# EAGLE schematic atum-le (EAGLE 6.5.0)
AUTHOR: Brad Campbell; REV: A; TITLE: Atum

## Sheet 1 of 2
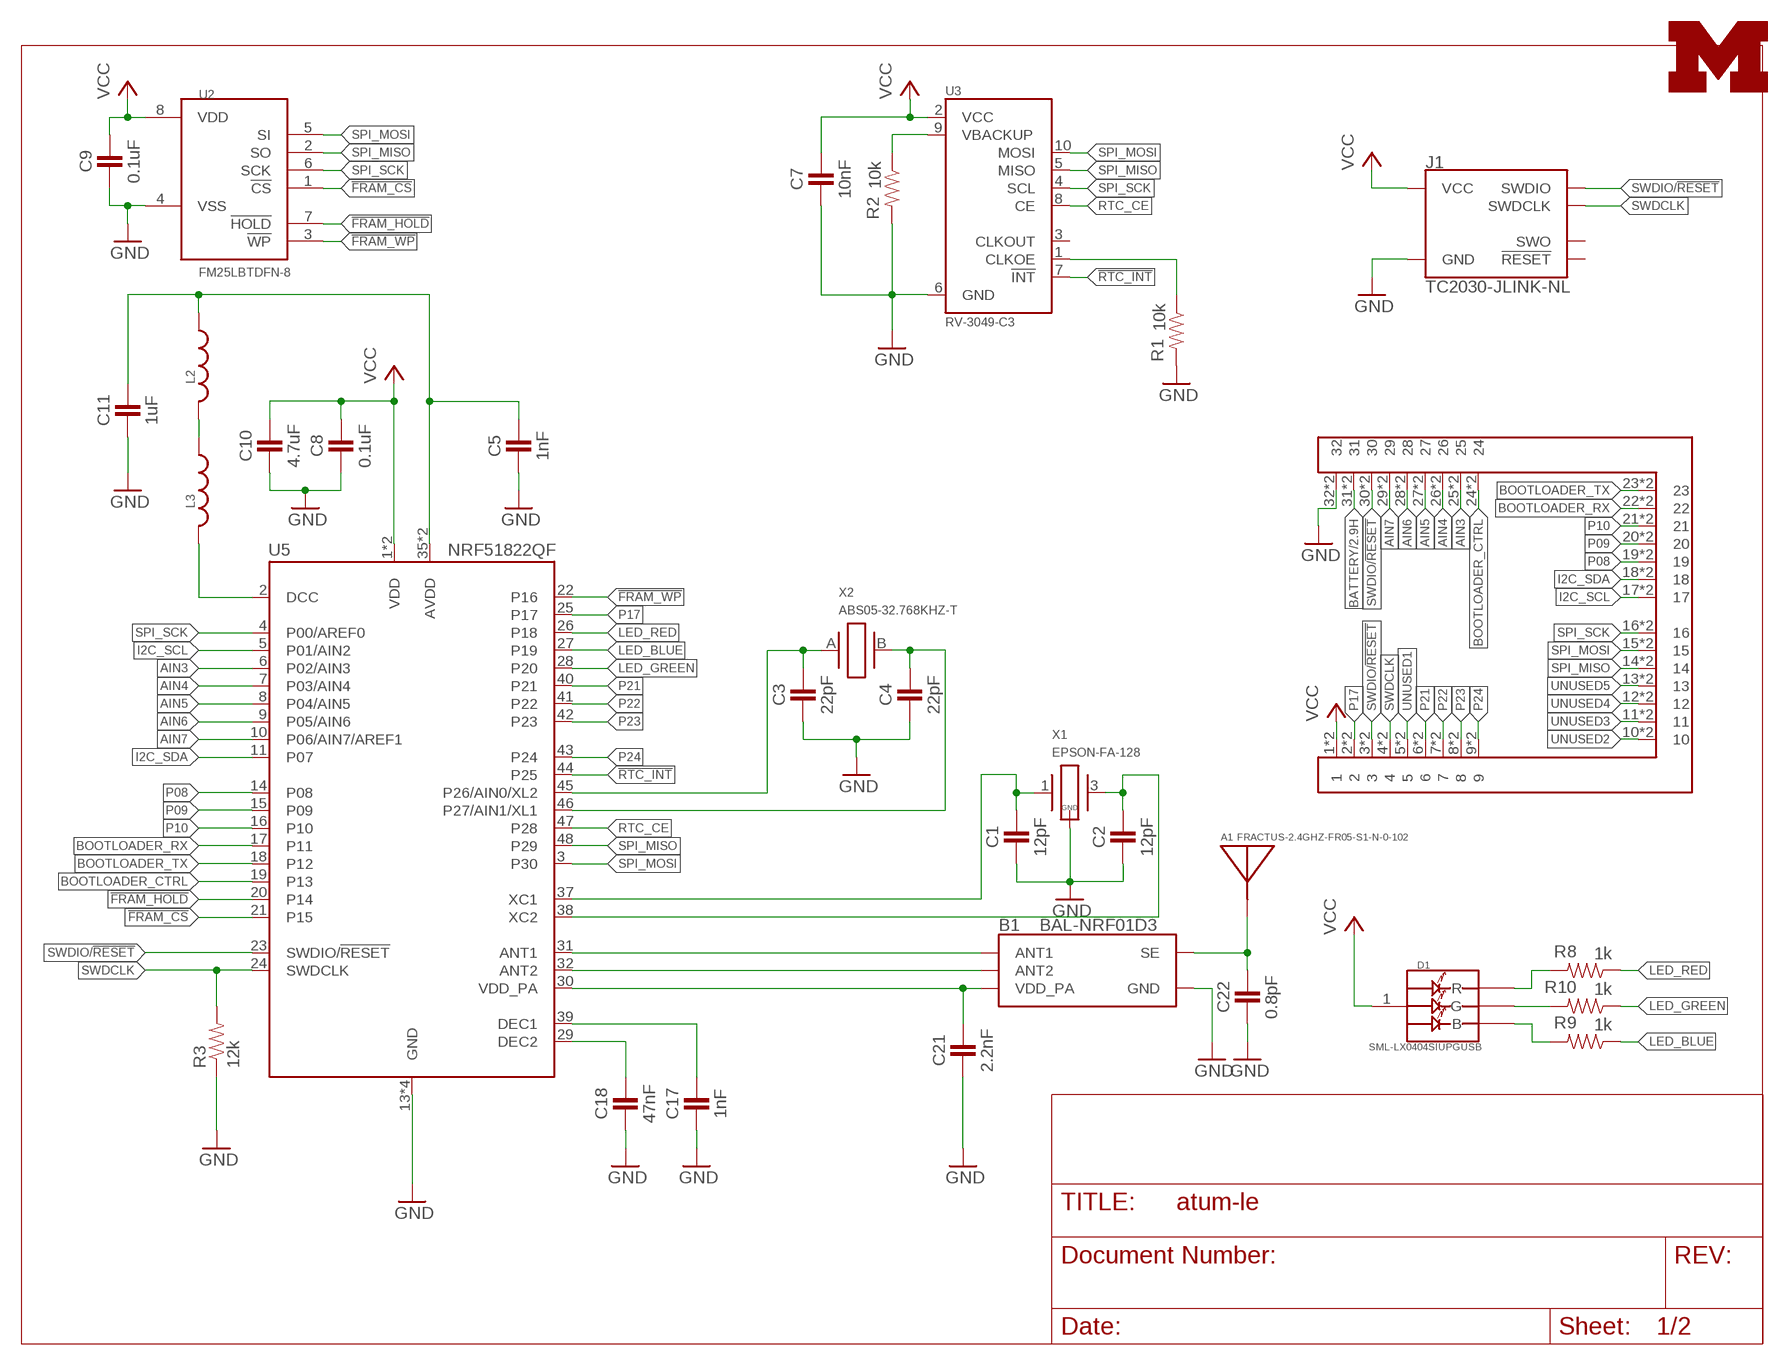
[diagram p0: schematic, sheet 1]

### Parts
A1  FRACTUS-2.4GHZ-FR05-S1-N-0-102  [FRACTUS-ANTENNA-FR05-S1-N-0-102]
B1  BAL-NRF01D3  [BAL-NRF01D3]
C1  12pF  CAPACITOR  [0402_CAP]
C2  12pF  CAPACITOR  [0402_CAP]
C3  22pF  CAPACITOR  [0402_CAP]
C4  22pF  CAPACITOR  [0402_CAP]
C5  1nF  CAPACITOR  [0402_CAP]
C7  10nF  CAPACITOR  [0402_CAP]
C8  0.1uF  CAPACITOR  [0402_CAP]
C9  0.1uF  CAPACITOR  [0402_CAP]
C10  4.7uF  CAPACITOR  [0402_CAP]
C11  1uF  CAPACITOR  [0402_CAP]
C17  1nF  CAPACITOR  [0402_CAP]
C18  47nF  CAPACITOR  [0402_CAP]
C21  2.2nF  CAPACITOR  [0402_CAP]
C22  0.8pF  CAPACITOR  [0402_CAP]
D1  SML-LX0404SIUPGUSB  [1MM_SQ_4PAD]
J1  TC2030-JLINK-NL  [TC2030-IDC-NL]
J3  ATUM-HEADER  [ATUM-HEADER]
L2  INDUCTOR0402  [0402_CAP]
L3  INDUCTOR0603  [0603_CAP]
LOGO1  UMICH_SOLID_TINY  [UMICH_SOLID_50MIL]
R1  10k  RESISTOR0402_RES  [0402_RES]
R2  10k  RESISTOR0402_RES  [0402_RES]
R3  12k  RESISTOR0402_RES  [0402_RES]
R8  1k  RESISTOR0402_RES  [0402_RES]
R9  1k  RESISTOR0402_RES  [0402_RES]
R10  1k  RESISTOR0402_RES  [0402_RES]
U2  FM25LBTDFN-8  [TDFN-8]
U3  RV-3049-C3  [MICRO-CRYSTAL-C3]
U5  NRF51822QF  [QFN-48-6MM]
X1  EPSON-FA-128  [FA-128]
X2  ABS05-32.768KHZ-T  [ABS05]

### Nets
!FRAM_CS: U2.1(!CS) U5.21(P15)
!FRAM_HOLD: U2.7(!HOLD) U5.20(P14)
!FRAM_WP: U2.3(!WP) U5.22(P16)
!RTC_INT: U3.7(!INT) U5.44(P25)
AIN3: J3.25 J3.25B U5.6(P02/AIN3)
AIN4: J3.26 J3.26B U5.7(P03/AIN4)
AIN5: J3.27 J3.27B U5.8(P04/AIN5)
AIN6: J3.28 J3.28B U5.9(P05/AIN6)
AIN7: J3.29 J3.29B U5.10(P06/AIN7/AREF1)
ANTENNA: A1.1(ANTENNA) B1.SE C22.1
BATTERY: J3.31 J3.31B ; also sheet 2
BOOTLOADER_CTRL: J3.24 J3.24B U5.19(P13)
BOOTLOADER_RX: J3.22 J3.22B U5.17(P11)
BOOTLOADER_TX: J3.23 J3.23B U5.18(P12)
GND: B1.GND C1.2 C2.2 C3.2 C4.2 C5.2 C7.2 C8.2 C9.2 C10.2 C11.2 C17.2 C18.2 C21.2 C22.2 J1.5(GND) J3.32 J3.32B R1.2 R2.2 R3.1 U2.4(VSS) U3.6(GND) X1.2(GND) X1.4(GND) ; also sheet 2
I2C_SCL: J3.17 J3.17B U5.5(P01/AIN2)
I2C_SDA: J3.18 J3.18B U5.11(P07)
LED_BLUE: R9.1 U5.27(P19)
LED_GREEN: R10.1 U5.28(P20)
LED_RED: R8.1 U5.26(P18)
N$6: C3.1 U5.45(P26/AIN0/XL2) X2.A
N$7: D1.2(R) R8.2
N$9: C1.1 U5.37(XC1) X1.1
N$10: C2.1 U5.38(XC2) X1.3
N$11: D1.4(G) R10.2
N$12: D1.3(B) R9.2
N$13: C4.1 U5.46(P27/AIN1/XL1) X2.B
N$14: R2.1 U3.9(VBACKUP)
N$15: C18.1 U5.29(DEC2)
N$16: R1.1 U3.1(CLKOE)
N$17: C17.1 U5.39(DEC1)
N$18: B1.ANT1 U5.31(ANT1)
N$19: B1.ANT2 U5.32(ANT2)
N$20: B1.VCC(VDD_PA) C21.1 U5.30(VDD_PA)
N$36: C5.1 C11.1 L2.1 U5.35(AVDD) U5.36(AVDD)
N$37: L2.2 L3.1
N$38: L3.2 U5.2(DCC)
P08: J3.19 J3.19B U5.14(P08)
P09: J3.20 J3.20B U5.15(P09)
P10: J3.21 J3.21B U5.16(P10)
P17: J3.2 J3.2B U5.25(P17)
P21: J3.6 J3.6B U5.40(P21)
P22: J3.7 J3.7B U5.41(P22)
P23: J3.8 J3.8B U5.42(P23)
P24: J3.9 J3.9B U5.43(P24)
RTC_CE: U3.8(CE) U5.47(P28)
SPI_MISO: J3.14 J3.14B U2.2(SO) U3.5(MISO) U5.48(P29)
SPI_MOSI: J3.15 J3.15B U2.5(SI) U3.10(MOSI) U5.3(P30)
SPI_SCK: J3.16 J3.16B U2.6(SCK) U3.4(SCL) U5.4(P00/AREF0)
SWDCLK: J1.4(SWDCLK) J3.4 J3.4B R3.2 U5.24(SWDCLK)
SWDIO/!RESET: J1.2(SWDIO) J3.3 J3.3B J3.30 J3.30B U5.23(SWDIO/!RESET)
UNUSED1: J3.5 J3.5B
UNUSED2: J3.10 J3.10B
UNUSED3: J3.11 J3.11B
UNUSED4: J3.12 J3.12B
UNUSED5: J3.13 J3.13B
VCC: C7.1 C8.1 C9.1 C10.1 D1.1(VDD) J1.1(VCC) J3.1 J3.1B U2.8(VDD) U3.2(VCC) U5.1(VDD) U5.12(VDD) ; also sheet 2
Unconnected: J1.3(!RESET) J1.6(SWO) U3.3(CLKOUT) U5.13(GND) U5.33(GND) U5.34(GND) U5.GND

## Sheet 2 of 2
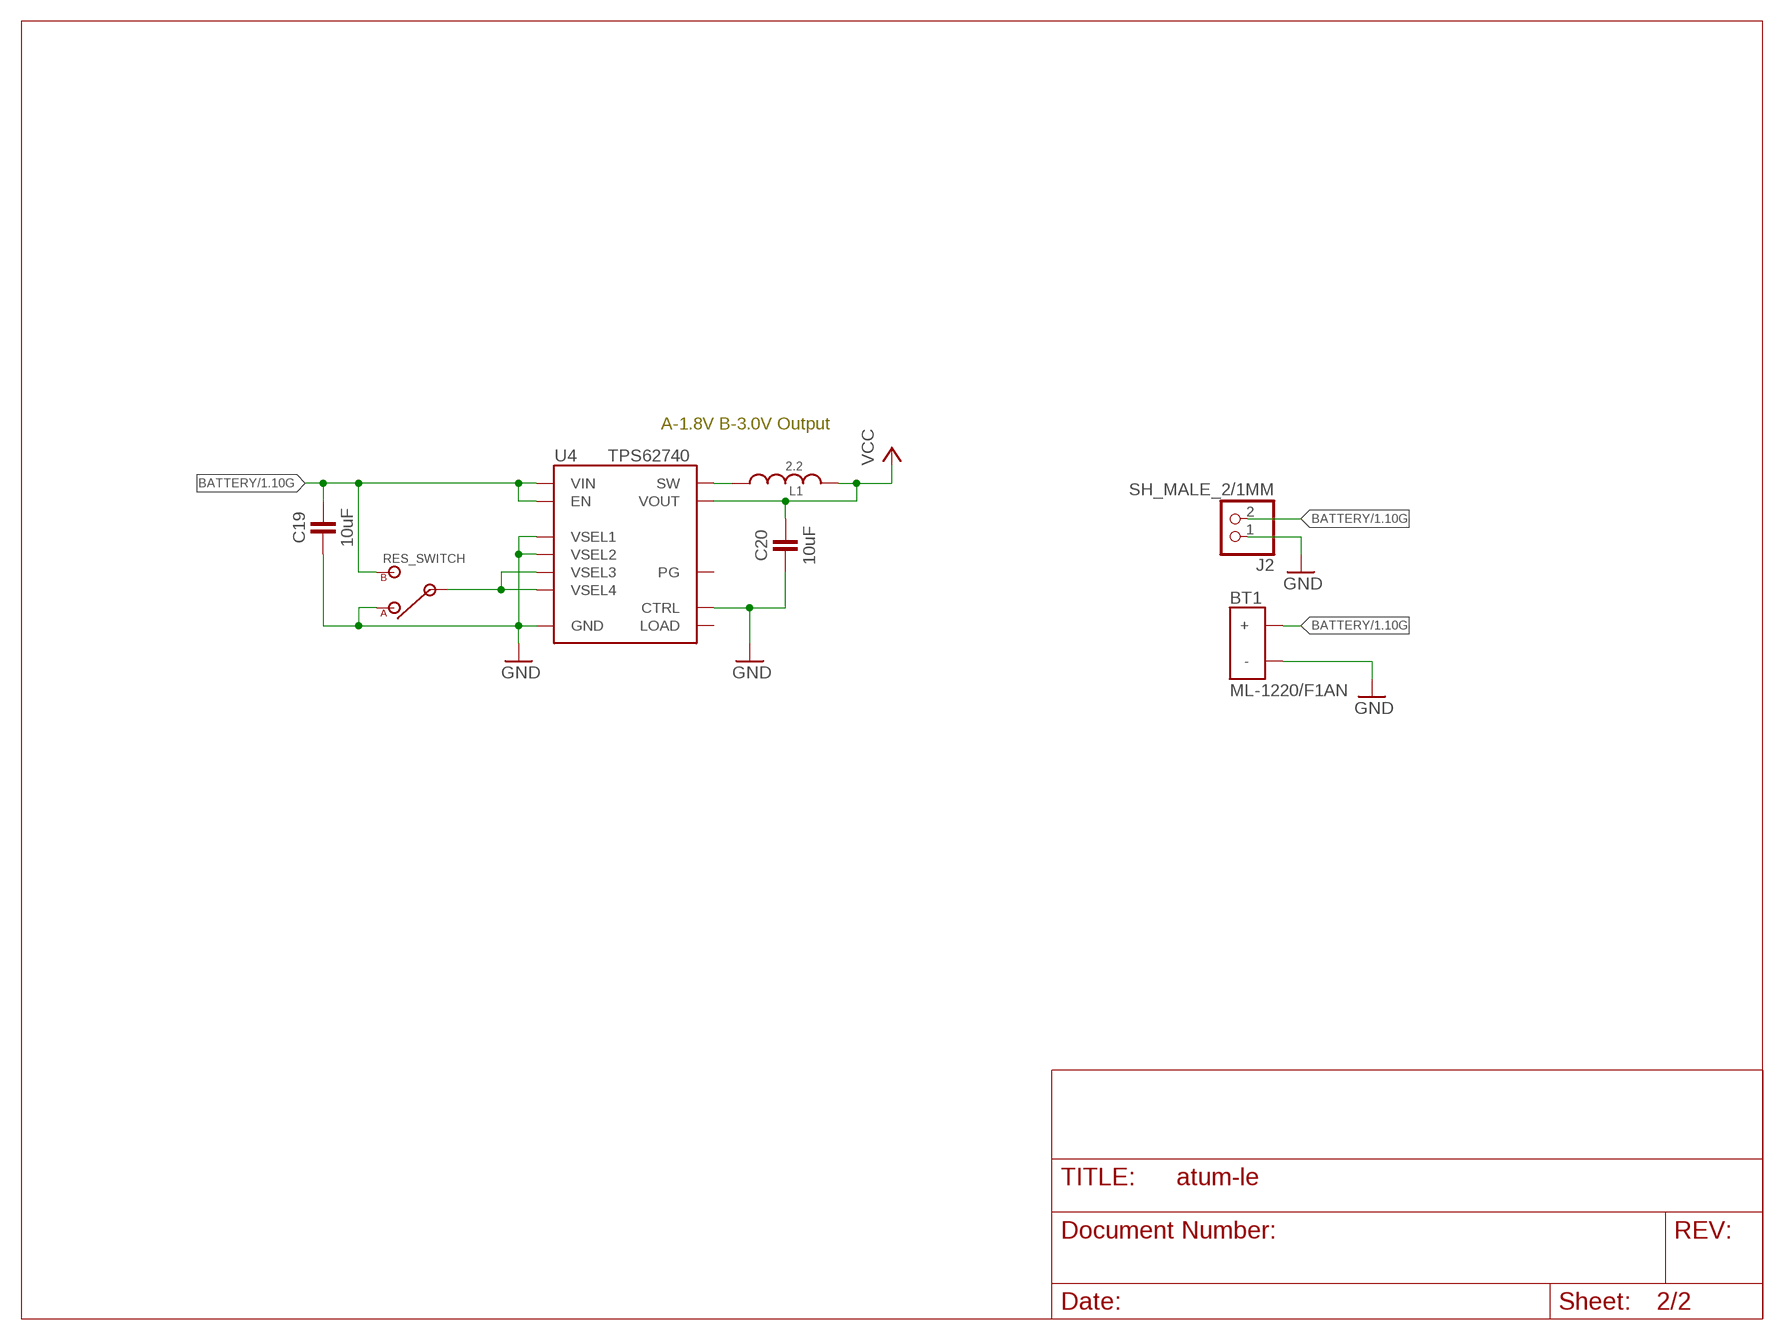
[diagram p1: schematic, sheet 2]

### Parts
BT1  ML-1220/F1AN  [ML-1220/F1BN]
C19  10uF  CAPACITOR0603_CAP  [0603_CAP]
C20  10uF  CAPACITOR0603_CAP  [0603_CAP]
J2  SH_MALE_2/1MM  [SH-1X2/1MM]
L1  2.2  MIPSZ2012D  [MIPSZ201D]
U4  TPS62740  [R-PWSON-12]
U$1  RES_SWITCH  [RES_SWITCH]

### Nets
BATTERY: BT1.POS(+) C19.1 J2.2 U4.1(VIN) U4.12(EN) U$1.B ; also sheet 1
GND: BT1.NEG(-) C19.2 C20.2 J2.1 U4.3(GND) U4.4(CTRL) U4.10(VSEL2) U4.11(VSEL1) U4.NC(GND) U$1.A ; also sheet 1
N$5: L1.1 U4.2(SW)
N$8: U4.8(VSEL4) U4.9(VSEL3) U$1.C(IN)
VCC: C20.1 L1.2 U4.5(VOUT) ; also sheet 1
Unconnected: U4.6(LOAD) U4.7(PG)

### Notes on the sheet
- A-1.8V B-3.0V Output

## Library data of the parts
A1 = chips:FRACTUS-2.4GHZ-FR05-S1-N-0-102: Fractus Compact Reach XtendTM chip antenna is engineered specifically for Bluetooth, WLAN 802.11 b/g/n and other wireless devices operating at the ISM 2.4 GHz band. Compact Reach Xtend combines small form factor size and high performance to improve the functionality of your wireless devices.; RICHARDSON_RFPD: FR05-S1-N-0102B
B1 = chips:BAL-NRF01D3: 50 ohm nominal input / conjugate match balun to nRF51422-QFAA, nRF24LE1, nRF51822-QFAA/AB, with integrated harmonic filter; DIGIKEY: 497-13637-1-ND; MOUSER: 511-BAL-NRF01D3
BT1 = batteries:ML-1220/F1AN: BATTERY LITH 3V RECHARGE PC PINS; DIGIKEY: P663-nd; MOUSER: 658-ML-1220/F1BN
C1-C5 C7-C11 C17 C18 C21 C22 = passives:CAPACITOR: 0402 Capacitor
C19 C20 = passives:CAPACITOR: 0402 Capacitor; DIGIKEY: 490-7316-1-ND
D1 = leds:SML-LX0404SIUPGUSB: 1mm^2 RGB LED; DIGIKEY: 67-2125-1-ND
J1 = connector:TC2030-JLINK
J2 = headers:SH_MALE_2/1MM: 1.0mm pitch/Disconnectable Crimp style connectors; DIGIKEY: 455-1788-2-ND
J3 = atum:ATUM-HEADER: Castellated header for the Atum board.
L1 = passives:MIPSZ2012D: FDK Multi-layer Power Inductor : MIPSZ2012D series (Very Small Type)
L2 L3 = passives:INDUCTOR
LOGO1 = logos:UMICH_SOLID
R1-R3 R8-R10 = passives:RESISTOR: Resistor Basic schematic elements and footprints for 0603, 1206, and PTH resistors.
U2 = chips:FM25LB: IC FRAM 4KBIT 10MHZ 8SOIC; DIGIKEY: FM25L04B-DGRA-ND; MOUSER: 877-FM25L04B-DG
U3 = chips:RV-3049-C3: The RV-3049-C3 is an ultra miniature Real-Time-Clock Module with embedded Crystal. This RTC has an SPI Bus (4-wire Serial- Interface) and offers temperature compensated time.
U4 = chips:TPS62740: 360nA Step Down Converter for Low Power Applications; DIGIKEY: 296-37134-1-ND; MOUSER: 595-TPS62740DSST; NEWARK: 27X9745
U5 = chips:NRF51822: Multiprotocol Bluetooth® 4.0 low energy/2.4 GHz RF SoC; DIGIKEY: 1490-1032-1-ND; MOUSER: 949-NRF51822-QFAB-R7
U$1 = switches:RES_SWITCH: 0402 Static Resistor Selector
X1 = crystals:EPSON-FA-128: MHz RANGE CRYSTAL UNIT ULTRA MINIATURE SIZE LOW PROFILE SMD http://www.digikey.com/product-search/en?FV=ffec63d1
X2 = crystals:ABS05-32.768KHZ: 32.768kHz Crystal; DIGIKEY: 535-11899-1-ND